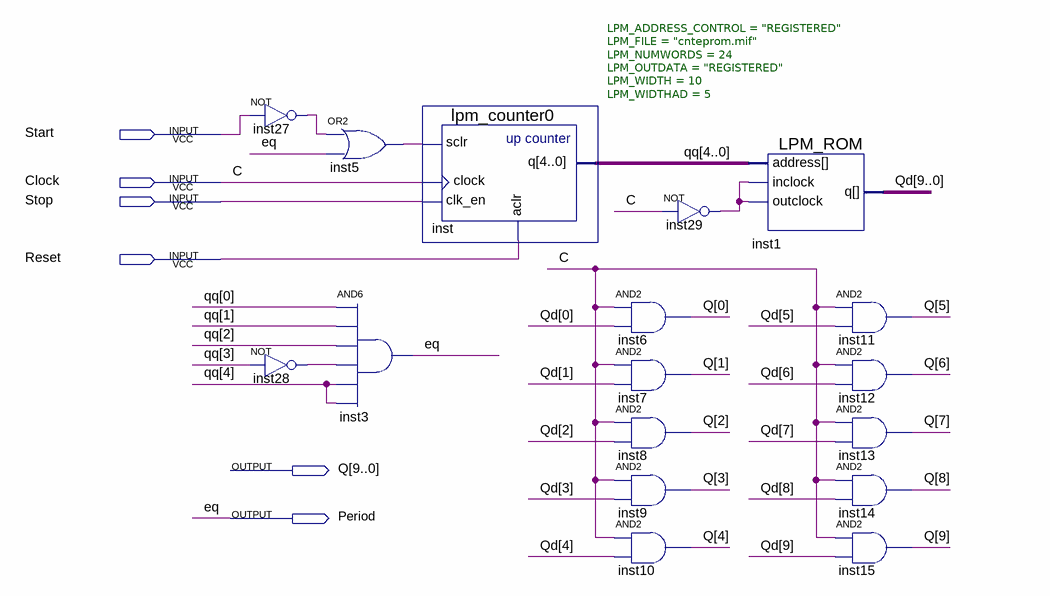
[diagram p0: schematic sheet]
// Quartus schematic cnteprom.bdf as structural Verilog: 17 symbols, 6 pins
module cnteprom (
  input  Start,
  input  Clock,
  input  Stop,
  input  Reset,
  output [9:0] Q,
  output Period
);

  wire inst5_out, inst27_out, inst28_out, inst29_out;
  wire [4:0] qq;
  wire [9:0] Qd;

  not inst27 (inst27_out, Start);
  not inst28 (inst28_out, qq[3]);
  or inst5 (inst5_out, inst27_out, Period);
  and inst3 (Period, qq[0], qq[1], qq[2], inst28_out, qq[4], qq[4]);
  lpm_counter0 inst (.sclr(inst5_out), .clock(Clock), .clk_en(Stop), .aclr(Reset), .q(qq));
  not inst29 (inst29_out, Clock);
  and inst6 (Q[0], Clock, Qd[0]);
  and inst7 (Q[1], Clock, Qd[1]);
  and inst8 (Q[2], Clock, Qd[2]);
  and inst9 (Q[3], Clock, Qd[3]);
  and inst10 (Q[4], Clock, Qd[4]);
  LPM_ROM #(.LPM_ADDRESS_CONTROL("REGISTERED"), .LPM_FILE("cnteprom.mif"), .LPM_NUMWORDS(24), .LPM_OUTDATA("REGISTERED"), .LPM_WIDTH(10), .LPM_WIDTHAD(5)) inst1 (
    .address(qq), .inclock(inst29_out), .outclock(inst29_out), .q(Qd));
  and inst11 (Q[5], Clock, Qd[5]);
  and inst12 (Q[6], Clock, Qd[6]);
  and inst13 (Q[7], Clock, Qd[7]);
  and inst14 (Q[8], Clock, Qd[8]);
  and inst15 (Q[9], Clock, Qd[9]);

  // Other names for the same wires on the sheet: C = Clock; eq = Period
endmodule
